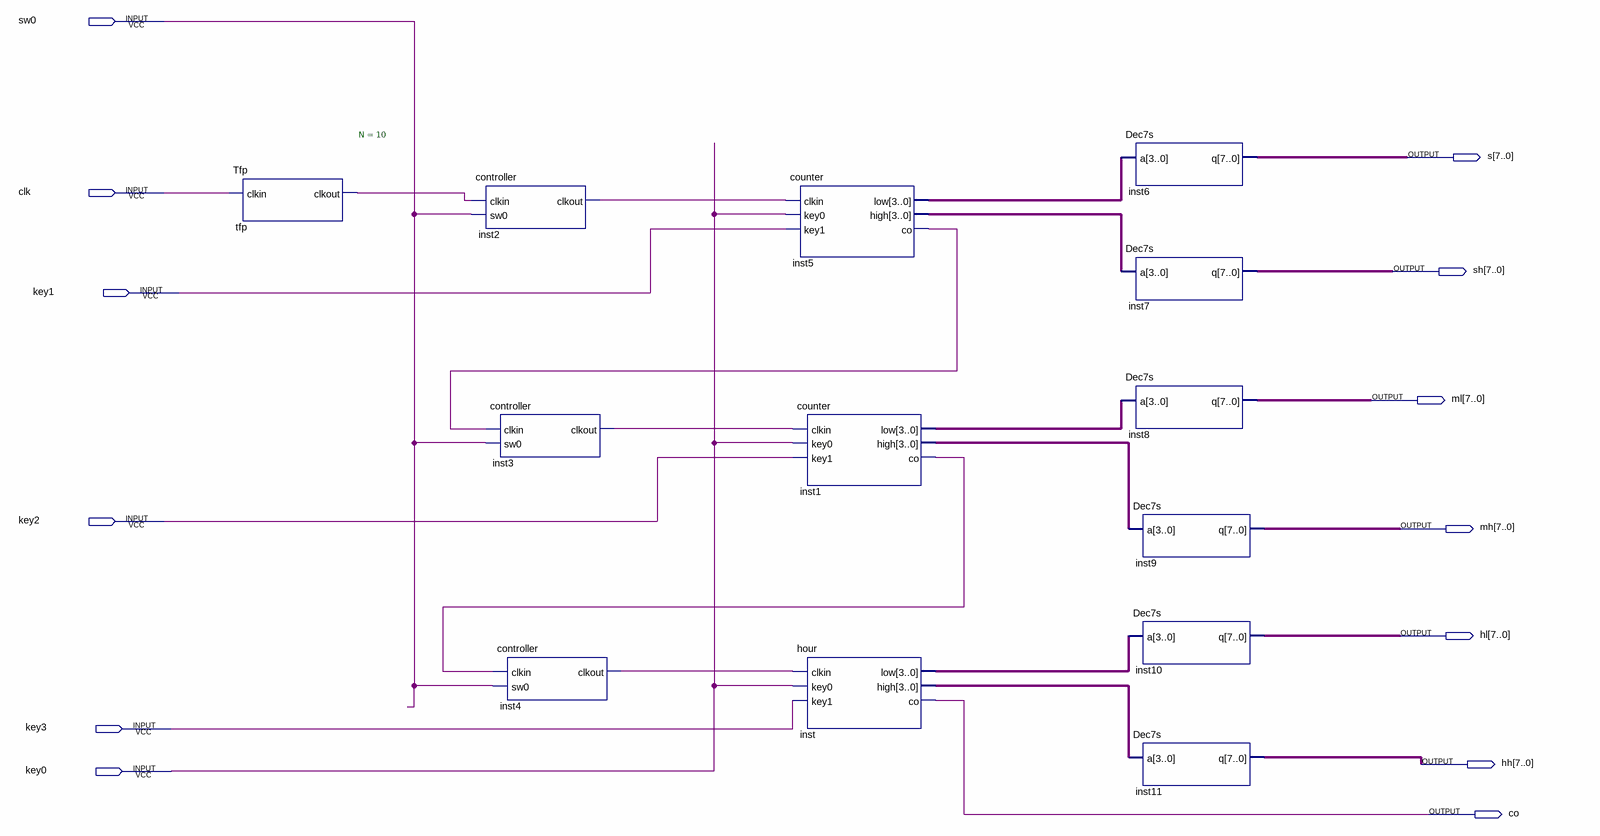
[diagram p0: schematic sheet]
// Quartus schematic timename.bdf as structural Verilog: 13 symbols, 13 pins
module timename (
  input  sw0,
  input  clk,
  input  key1,
  input  key2,
  input  key3,
  input  key0,
  output [7:0] s,
  output [7:0] sh,
  output [7:0] ml,
  output [7:0] mh,
  output [7:0] hl,
  output [7:0] hh,
  output co
);

  wire inst1_co, inst2_clkout, inst3_clkout, inst4_clkout, inst5_co, tfp_clkout;
  wire [3:0] inst1_high, inst1_low, inst5_high, inst5_low, inst_high, inst_low;

  Tfp #(.N(10)) tfp (.clkin(clk), .clkout(tfp_clkout));
  controller inst2 (.clkin(tfp_clkout), .sw0(sw0), .clkout(inst2_clkout));
  controller inst3 (.clkin(inst5_co), .sw0(sw0), .clkout(inst3_clkout));
  controller inst4 (.clkin(inst1_co), .sw0(sw0), .clkout(inst4_clkout));
  counter inst5 (.clkin(inst2_clkout), .key0(key0), .key1(key1), .low(inst5_low), .high(inst5_high), .co(inst5_co));
  counter inst1 (.clkin(inst3_clkout), .key0(key0), .key1(key2), .low(inst1_low), .high(inst1_high), .co(inst1_co));
  hour inst (.clkin(inst4_clkout), .key0(key0), .key1(key3), .low(inst_low), .high(inst_high), .co(co));
  Dec7s inst6 (.a(inst5_low), .q(s));
  Dec7s inst7 (.a(inst5_high), .q(sh));
  Dec7s inst8 (.a(inst1_low), .q(ml));
  Dec7s inst9 (.a(inst1_high), .q(mh));
  Dec7s inst10 (.a(inst_low), .q(hl));
  Dec7s inst11 (.a(inst_high), .q(hh));
endmodule
